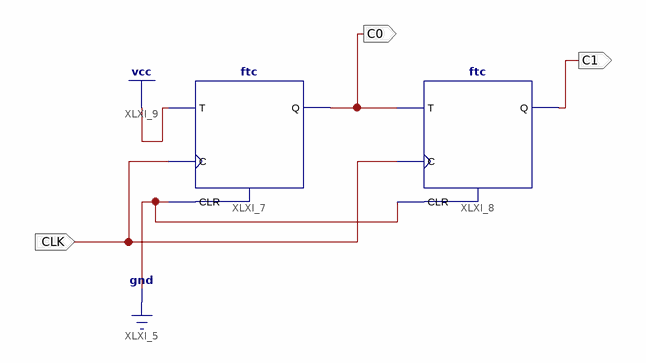
[diagram p0: schematic sheet 1]
// Xilinx ISE schematic counter0_3.sch (spartan6) as structural Verilog: 2 symbols, 3 ports
module counter0_3 (
  input  CLK,
  output C0,
  output C1
);

  ftc XLXI_7 (.C(CLK), .CLR(1'b0), .T(1'b1), .Q(C0));
  ftc XLXI_8 (.C(CLK), .CLR(1'b0), .T(C0), .Q(C1));
endmodule
